# EAGLE schematic DCC-command-center-V2 (EAGLE 7.4.0)

## Sheet 1 of 3
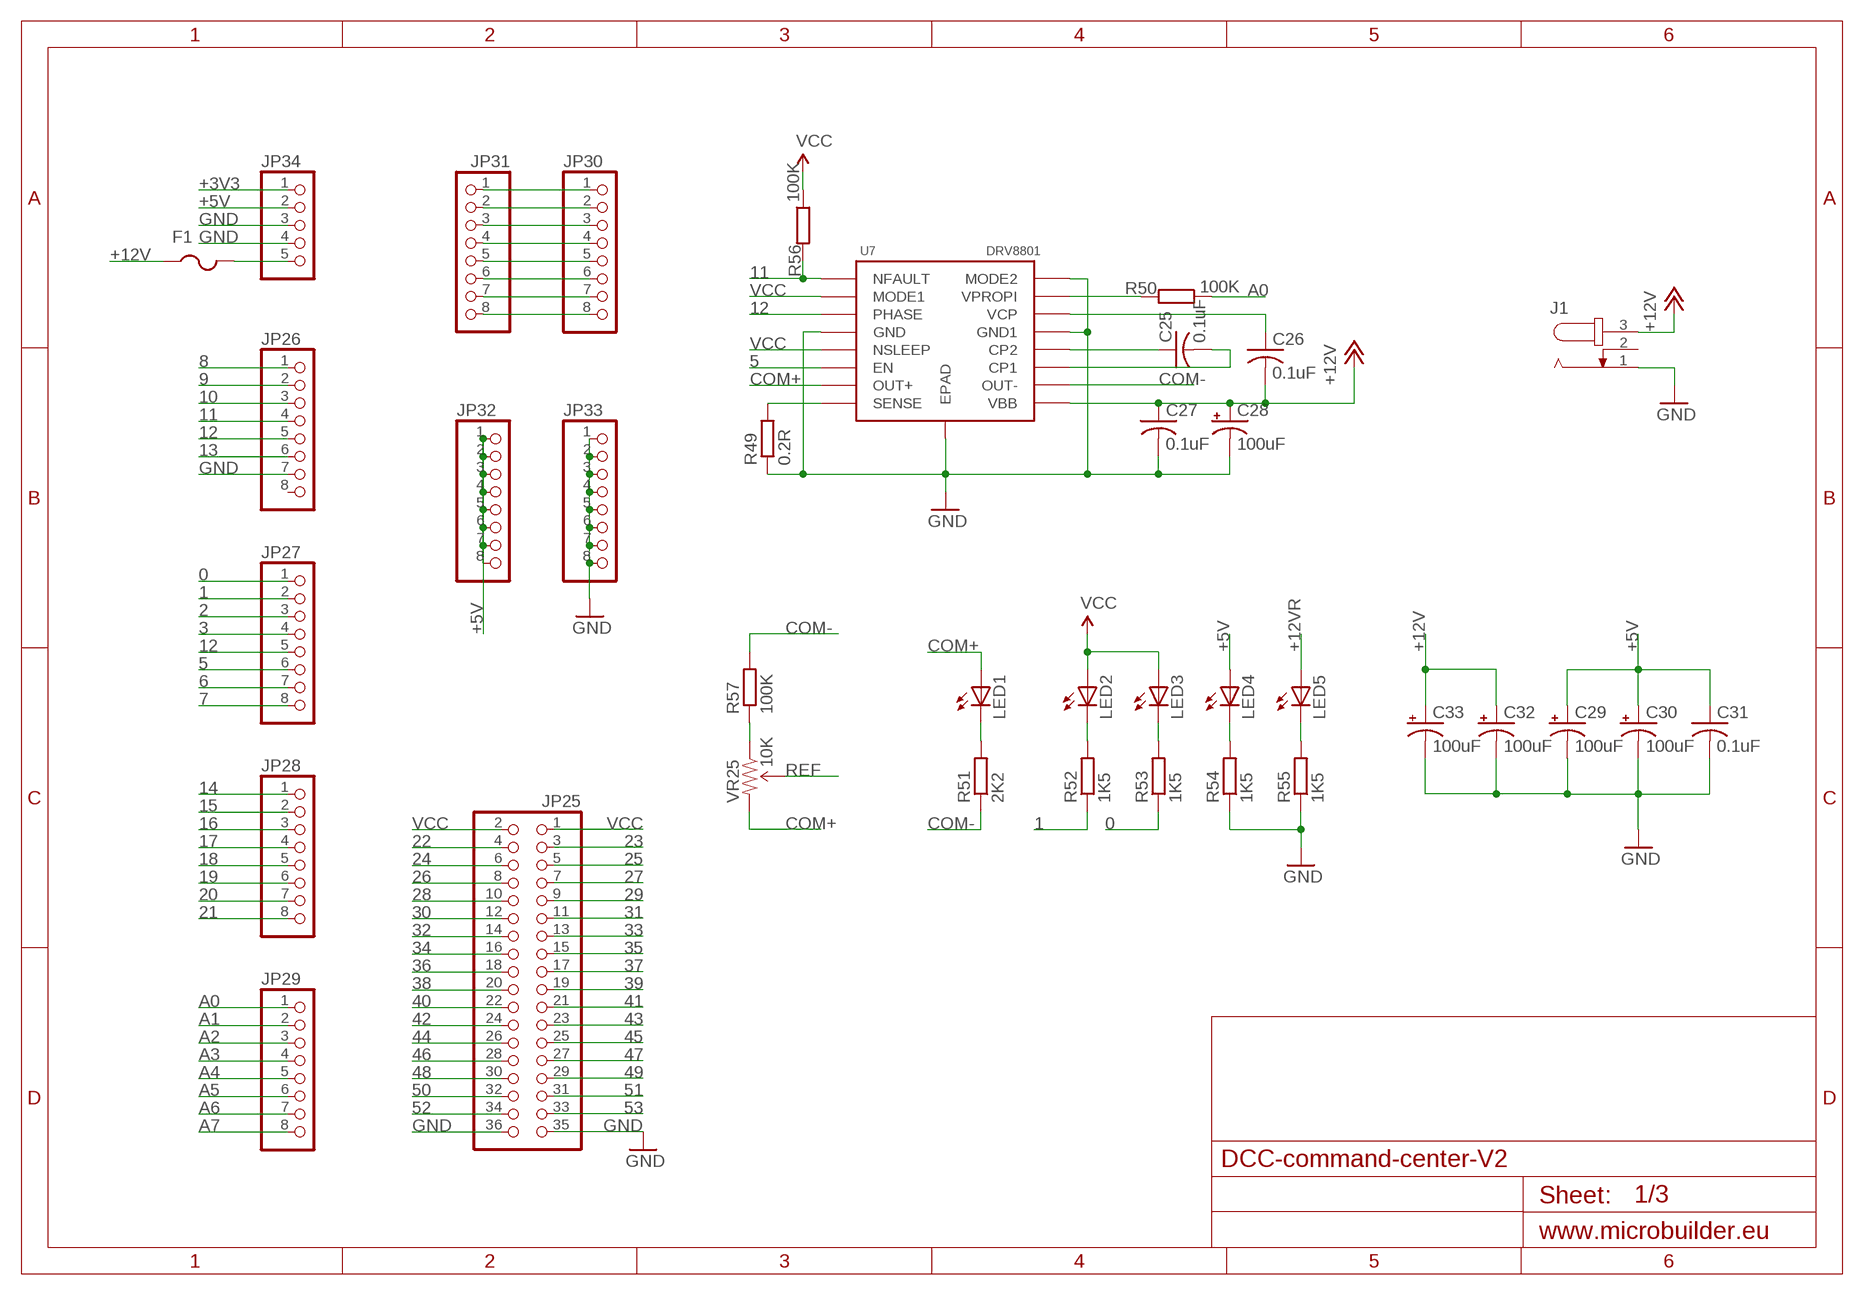
[diagram p0: schematic, sheet 1]

### Parts
C25  0.1uF  C-USC0603  [C0603]
C26  0.1uF  C-USC0603  [C0603]
C27  0.1uF  C-USC0603  [C0603]
C28  100uF  CPOL-US153CLV-0505  [153CLV-0505]
C29  100uF  CPOL-US153CLV-0505  [153CLV-0505]
C30  100uF  CPOL-US153CLV-0505  [153CLV-0505]
C31  0.1uF  C-USC0603  [C0603]
C32  100uF  CPOL-US153CLV-0505  [153CLV-0505]
C33  100uF  CPOL-US153CLV-0505  [153CLV-0505]
F1  PTCFUSE-1812  [1812]
J1  RAPC7120  [RAPC712]
JP25  PINHD-2X18_2.54  [2X18]
JP26  PINHD-1X08_2.54-S  [1X08-S]
JP27  PINHD-1X08_2.54-S  [1X08-S]
JP28  PINHD-1X08_2.54-S  [1X08-S]
JP29  PINHD-1X08_2.54-S  [1X08-S]
JP30  PINHD-1X08_2.54-S  [1X08-S]
JP31  PINHD-1X08_2.54-S  [1X08-S]
JP32  PINHD-1X08_2.54-S  [1X08-S]
JP33  PINHD-1X08_2.54-S  [1X08-S]
JP34  PINHD-1X05_2.54-S  [1X05-S]
LED1  LEDCHIP-LED0603  [CHIP-LED0603]
LED2  LEDCHIP-LED0603  [CHIP-LED0603]
LED3  LEDCHIP-LED0603  [CHIP-LED0603]
LED4  LEDCHIP-LED0603  [CHIP-LED0603]
LED5  LEDCHIP-LED0603  [CHIP-LED0603]
R49  0.2R  R-EU_R2512  [R2512]
R50  100K  R-EU_R0603  [R0603]
R51  2K2  R-EU_R0603  [R0603]
R52  1K5  R-EU_R0603  [R0603]
R53  1K5  R-EU_R0603  [R0603]
R54  1K5  R-EU_R0603  [R0603]
R55  1K5  R-EU_R0603  [R0603]
R56  100K  R-EU_R0603  [R0603]
R57  100K  R-EU_R0603  [R0603]
U7  DRV8801  [HTSSOP16]
VR25  10K  TRIMPOT3MM-2  [TRIMPOT-3MM-2]

### Nets
0: JP27.1 R53.1
1: JP27.2 R52.1
2: JP27.3
3: JP27.4
5: JP27.6 U7.P$6(EN)
6: JP27.7
7: JP27.8
8: JP26.1
9: JP26.2
10: JP26.3
11: JP26.4 R56.2 U7.P$1(NFAULT)
12: JP26.5 JP27.5 U7.P$3(PHASE)
13: JP26.6
14: JP28.1
15: JP28.2
16: JP28.3
17: JP28.4
18: JP28.5
19: JP28.6
20: JP28.7
21: JP28.8
22: JP25.4 ; also sheet 2
23: JP25.3 ; also sheet 2
24: JP25.6 ; also sheet 2
25: JP25.5 ; also sheet 2
26: JP25.8 ; also sheet 2
27: JP25.7 ; also sheet 2
28: JP25.10 ; also sheet 2
29: JP25.9 ; also sheet 2
30: JP25.12 ; also sheet 2
31: JP25.11 ; also sheet 2
32: JP25.14 ; also sheet 2
33: JP25.13 ; also sheet 2
34: JP25.16 ; also sheet 3
35: JP25.15 ; also sheet 3
36: JP25.18 ; also sheet 3
37: JP25.17 ; also sheet 3
38: JP25.20 ; also sheet 3
39: JP25.19 ; also sheet 3
40: JP25.22 ; also sheet 3
41: JP25.21 ; also sheet 3
42: JP25.24 ; also sheet 3
43: JP25.23 ; also sheet 3
44: JP25.26 ; also sheet 3
45: JP25.25 ; also sheet 3
46: JP25.28
47: JP25.27
48: JP25.30
49: JP25.29
50: JP25.32
51: JP25.31
52: JP25.34
53: JP25.33
+3V3: JP34.1
+5V: C29.+ C30.+ C31.1 JP32.1 JP32.2 JP32.3 JP32.4 JP32.5 JP32.6 JP32.7 JP32.8 JP34.2 LED4.A
+12V: C26.2 C27.1 C28.+ C32.+ C33.+ F1.1 J1.3 U7.P$9(VBB)
+12VR: F1.2 JP34.5 LED5.A
A0: JP29.1 R50.1
A1: JP29.2
A2: JP29.3
A3: JP29.4
A4: JP29.5
A5: JP29.6
A6: JP29.7
A7: JP29.8
COM+: LED1.A U7.P$7(OUT+) VR25.3(CW) ; also sheet 2,3
COM-: R51.1 R57.2 U7.P$10(OUT-) ; also sheet 2,3
GND: C27.2 C28.- C29.- C30.- C31.2 C32.- C33.- J1.1 JP25.35 JP25.36 JP26.7 JP33.1 JP33.2 JP33.3 JP33.4 JP33.5 JP33.6 JP33.7 JP33.8 JP34.3 JP34.4 R49.1 R54.1 R55.1 U7.P$4(GND) U7.P$13(GND1) U7.P$16(MODE2) U7.P$17(EPAD) ; also sheet 2,3
N$1: JP30.1 JP31.1
N$2: JP30.2 JP31.2
N$3: JP30.3 JP31.3
N$4: JP30.4 JP31.4
N$5: JP30.5 JP31.5
N$6: JP30.6 JP31.6
N$7: JP30.7 JP31.7
N$8: JP30.8 JP31.8
N$9: R49.2 U7.P$8(SENSE)
N$10: C25.1 U7.P$12(CP2)
N$11: C25.2 U7.P$11(CP1)
N$12: C26.1 U7.P$14(VCP)
N$13: R57.1 VR25.1(CCW)
N$14: R50.2 U7.P$15(VPROPI)
N$15: LED1.C R51.2
N$16: LED2.C R52.2
N$17: LED3.C R53.2
N$18: LED4.C R54.2
N$19: LED5.C R55.2
REF: VR25.2(WIPER) ; also sheet 2,3
VCC: JP25.1 JP25.2 LED2.A LED3.A R56.1 U7.P$2(MODE1) U7.P$5(NSLEEP) ; also sheet 2,3
Unconnected: J1.2 JP26.8

## Sheet 2 of 3
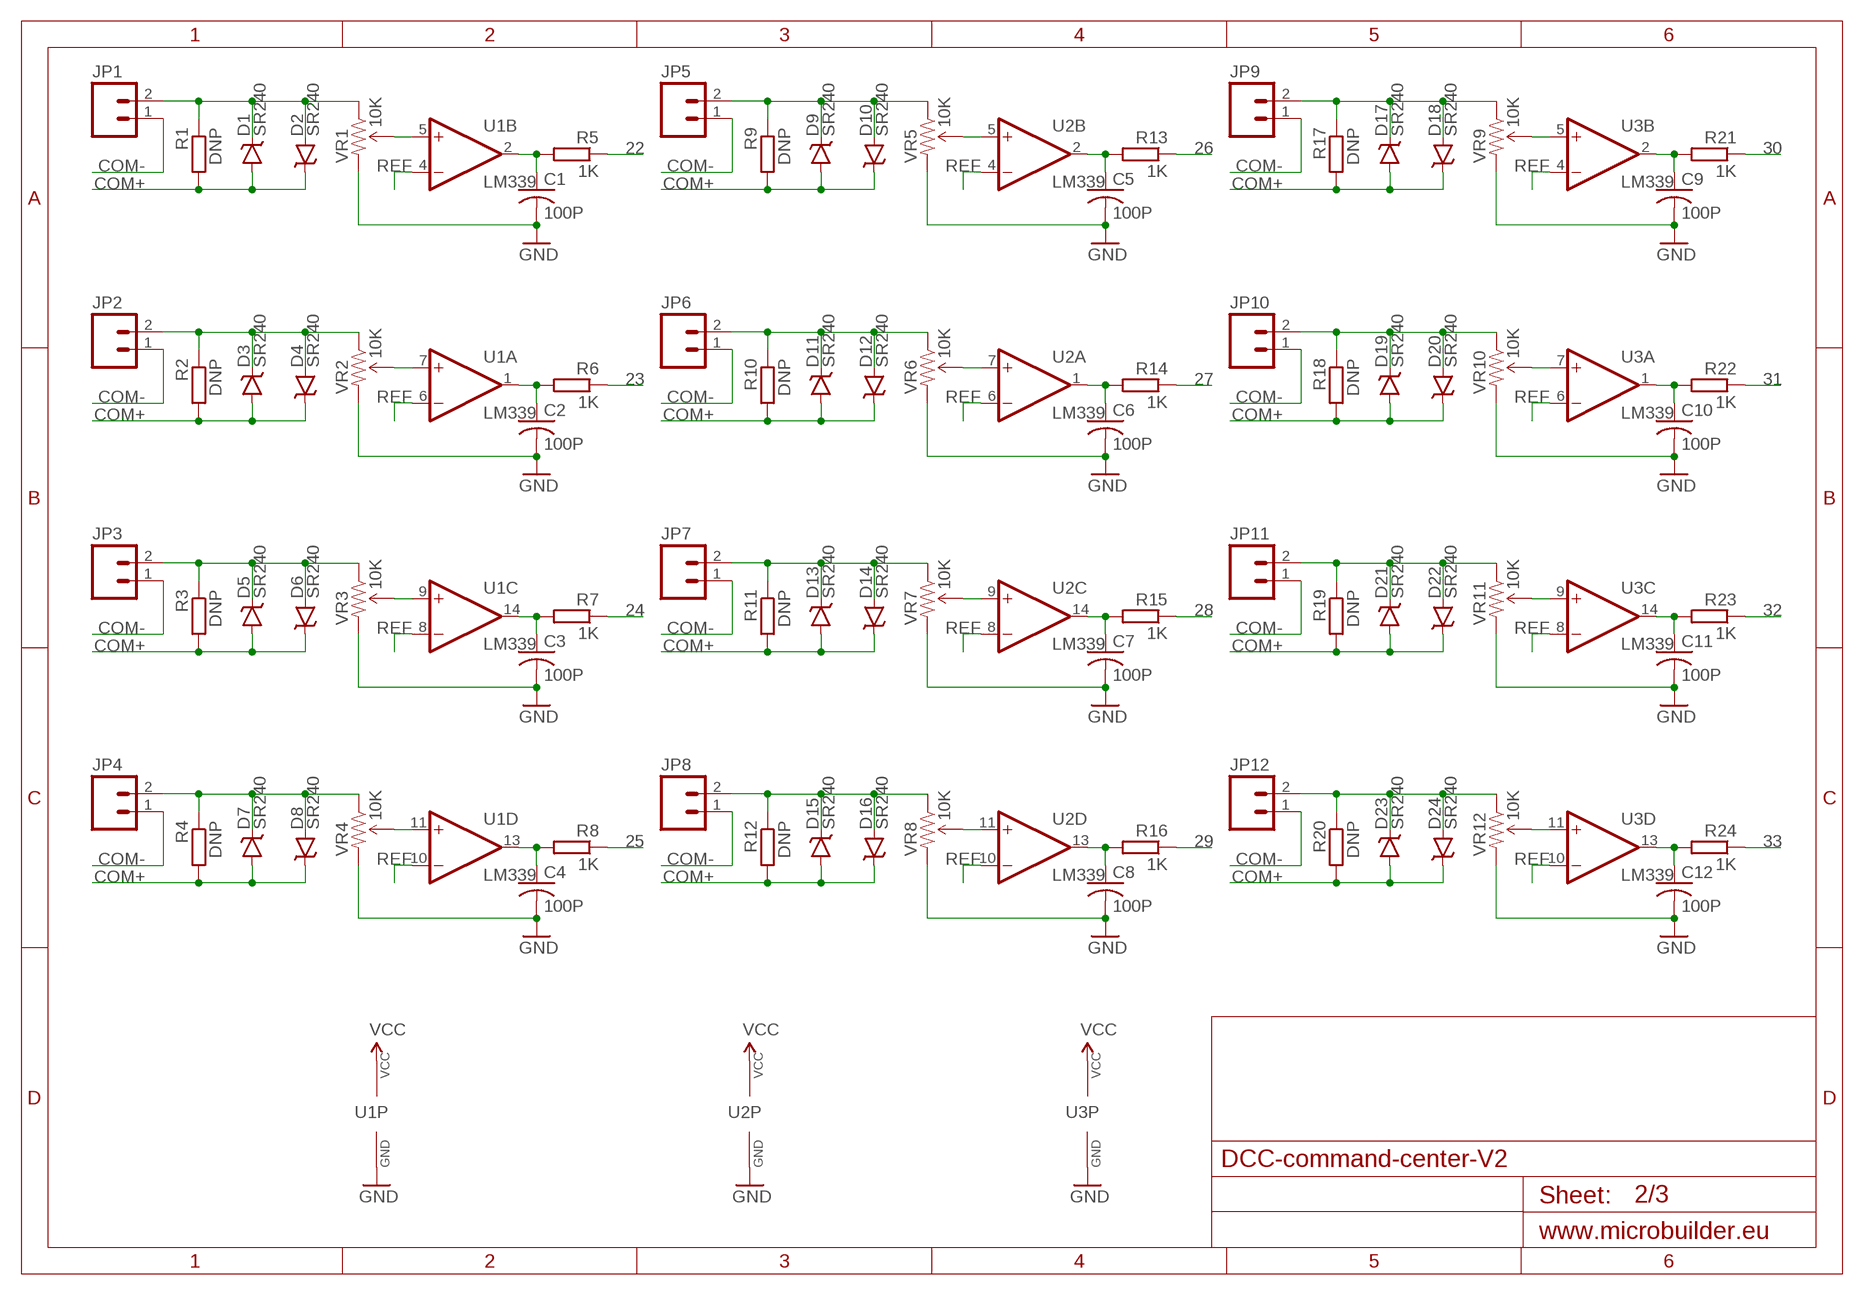
[diagram p1: schematic, sheet 2]

### Parts
C1  100P  C-USC0603  [C0603]
C2  100P  C-USC0603  [C0603]
C3  100P  C-USC0603  [C0603]
C4  100P  C-USC0603  [C0603]
C5  100P  C-USC0603  [C0603]
C6  100P  C-USC0603  [C0603]
C7  100P  C-USC0603  [C0603]
C8  100P  C-USC0603  [C0603]
C9  100P  C-USC0603  [C0603]
C10  100P  C-USC0603  [C0603]
C11  100P  C-USC0603  [C0603]
C12  100P  C-USC0603  [C0603]
D1  SR240  B340A  [SMA-DIODE]
D2  SR240  B340A  [SMA-DIODE]
D3  SR240  B340A  [SMA-DIODE]
D4  SR240  B340A  [SMA-DIODE]
D5  SR240  B340A  [SMA-DIODE]
D6  SR240  B340A  [SMA-DIODE]
D7  SR240  B340A  [SMA-DIODE]
D8  SR240  B340A  [SMA-DIODE]
D9  SR240  B340A  [SMA-DIODE]
D10  SR240  B340A  [SMA-DIODE]
D11  SR240  B340A  [SMA-DIODE]
D12  SR240  B340A  [SMA-DIODE]
D13  SR240  B340A  [SMA-DIODE]
D14  SR240  B340A  [SMA-DIODE]
D15  SR240  B340A  [SMA-DIODE]
D16  SR240  B340A  [SMA-DIODE]
D17  SR240  B340A  [SMA-DIODE]
D18  SR240  B340A  [SMA-DIODE]
D19  SR240  B340A  [SMA-DIODE]
D20  SR240  B340A  [SMA-DIODE]
D21  SR240  B340A  [SMA-DIODE]
D22  SR240  B340A  [SMA-DIODE]
D23  SR240  B340A  [SMA-DIODE]
D24  SR240  B340A  [SMA-DIODE]
JP1  M02POGO_PIN_HOLES_ONLY  [1X02_PP_HOLES_ONLY]
JP2  M02POGO_PIN_HOLES_ONLY  [1X02_PP_HOLES_ONLY]
JP3  M02POGO_PIN_HOLES_ONLY  [1X02_PP_HOLES_ONLY]
JP4  M02POGO_PIN_HOLES_ONLY  [1X02_PP_HOLES_ONLY]
JP5  M02POGO_PIN_HOLES_ONLY  [1X02_PP_HOLES_ONLY]
JP6  M02POGO_PIN_HOLES_ONLY  [1X02_PP_HOLES_ONLY]
JP7  M02POGO_PIN_HOLES_ONLY  [1X02_PP_HOLES_ONLY]
JP8  M02POGO_PIN_HOLES_ONLY  [1X02_PP_HOLES_ONLY]
JP9  M02POGO_PIN_HOLES_ONLY  [1X02_PP_HOLES_ONLY]
JP10  M02POGO_PIN_HOLES_ONLY  [1X02_PP_HOLES_ONLY]
JP11  M02POGO_PIN_HOLES_ONLY  [1X02_PP_HOLES_ONLY]
JP12  M02POGO_PIN_HOLES_ONLY  [1X02_PP_HOLES_ONLY]
R1  DNP  R-EU_R0603  [R0603]
R2  DNP  R-EU_R0603  [R0603]
R3  DNP  R-EU_R0603  [R0603]
R4  DNP  R-EU_R0603  [R0603]
R5  1K  R-EU_R0603  [R0603]
R6  1K  R-EU_R0603  [R0603]
R7  1K  R-EU_R0603  [R0603]
R8  1K  R-EU_R0603  [R0603]
R9  DNP  R-EU_R0603  [R0603]
R10  DNP  R-EU_R0603  [R0603]
R11  DNP  R-EU_R0603  [R0603]
R12  DNP  R-EU_R0603  [R0603]
R13  1K  R-EU_R0603  [R0603]
R14  1K  R-EU_R0603  [R0603]
R15  1K  R-EU_R0603  [R0603]
R16  1K  R-EU_R0603  [R0603]
R17  DNP  R-EU_R0603  [R0603]
R18  DNP  R-EU_R0603  [R0603]
R19  DNP  R-EU_R0603  [R0603]
R20  DNP  R-EU_R0603  [R0603]
R21  1K  R-EU_R0603  [R0603]
R22  1K  R-EU_R0603  [R0603]
R23  1K  R-EU_R0603  [R0603]
R24  1K  R-EU_R0603  [R0603]
U1  LM339  [TSSOP-14]
U2  LM339  [TSSOP-14]
U3  LM339  [TSSOP-14]
VR1  10K  TRIMPOT3MM-2  [TRIMPOT-3MM-2]
VR2  10K  TRIMPOT3MM-2  [TRIMPOT-3MM-2]
VR3  10K  TRIMPOT3MM-2  [TRIMPOT-3MM-2]
VR4  10K  TRIMPOT3MM-2  [TRIMPOT-3MM-2]
VR5  10K  TRIMPOT3MM-2  [TRIMPOT-3MM-2]
VR6  10K  TRIMPOT3MM-2  [TRIMPOT-3MM-2]
VR7  10K  TRIMPOT3MM-2  [TRIMPOT-3MM-2]
VR8  10K  TRIMPOT3MM-2  [TRIMPOT-3MM-2]
VR9  10K  TRIMPOT3MM-2  [TRIMPOT-3MM-2]
VR10  10K  TRIMPOT3MM-2  [TRIMPOT-3MM-2]
VR11  10K  TRIMPOT3MM-2  [TRIMPOT-3MM-2]
VR12  10K  TRIMPOT3MM-2  [TRIMPOT-3MM-2]

### Nets
22: R5.1 ; also sheet 1
23: R6.1 ; also sheet 1
24: R7.1 ; also sheet 1
25: R8.1 ; also sheet 1
26: R13.1 ; also sheet 1
27: R14.1 ; also sheet 1
28: R15.1 ; also sheet 1
29: R16.1 ; also sheet 1
30: R21.1 ; also sheet 1
31: R22.1 ; also sheet 1
32: R23.1 ; also sheet 1
33: R24.1 ; also sheet 1
COM+: D1.A D2.C D3.A D4.C D5.A D6.C D7.A D8.C D9.A D10.C D11.A D12.C D13.A D14.C D15.A D16.C D17.A D18.C D19.A D20.C D21.A D22.C D23.A D24.C R1.2 R2.2 R3.2 R4.2 R9.2 R10.2 R11.2 R12.2 R17.2 R18.2 R19.2 R20.2 ; also sheet 1,3
COM-: JP1.1 JP2.1 JP3.1 JP4.1 JP5.1 JP6.1 JP7.1 JP8.1 JP9.1 JP10.1 JP11.1 JP12.1 ; also sheet 1,3
GND: C1.2 C2.2 C3.2 C4.2 C5.2 C6.2 C7.2 C8.2 C9.2 C10.2 C11.2 C12.2 U1.12(P:GND) U2.12(P:GND) U3.12(P:GND) VR1.3(CW) VR2.3(CW) VR3.3(CW) VR4.3(CW) VR5.3(CW) VR6.3(CW) VR7.3(CW) VR8.3(CW) VR9.3(CW) VR10.3(CW) VR11.3(CW) VR12.3(CW) ; also sheet 1,3
JP1: D1.C D2.A JP1.2 R1.1 VR1.1(CCW)
JP2: D3.C D4.A JP2.2 R2.1 VR2.1(CCW)
JP3: D5.C D6.A JP3.2 R3.1 VR3.1(CCW)
JP4: D7.C D8.A JP4.2 R4.1 VR4.1(CCW)
JP5: D9.C D10.A JP5.2 R9.1 VR5.1(CCW)
JP6: D11.C D12.A JP6.2 R10.1 VR6.1(CCW)
JP7: D13.C D14.A JP7.2 R11.1 VR7.1(CCW)
JP8: D15.C D16.A JP8.2 R12.1 VR8.1(CCW)
JP9: D17.C D18.A JP9.2 R17.1 VR9.1(CCW)
JP10: D19.C D20.A JP10.2 R18.1 VR10.1(CCW)
JP11: D21.C D22.A JP11.2 R19.1 VR11.1(CCW)
JP12: D23.C D24.A JP12.2 R20.1 VR12.1(CCW)
OP1: C1.1 R5.2 U1.2(B:OUT)
OP2: C2.1 R6.2 U1.1(A:OUT)
OP3: C3.1 R7.2 U1.14(C:OUT)
OP4: C4.1 R8.2 U1.13(D:OUT)
OP5: C5.1 R13.2 U2.2(B:OUT)
OP6: C6.1 R14.2 U2.1(A:OUT)
OP7: C7.1 R15.2 U2.14(C:OUT)
OP8: C8.1 R16.2 U2.13(D:OUT)
OP9: C9.1 R21.2 U3.2(B:OUT)
OP10: C10.1 R22.2 U3.1(A:OUT)
OP11: C11.1 R23.2 U3.14(C:OUT)
OP12: C12.1 R24.2 U3.13(D:OUT)
REF: U1.4(B:-IN) U1.6(A:-IN) U1.8(C:-IN) U1.10(D:-IN) U2.4(B:-IN) U2.6(A:-IN) U2.8(C:-IN) U2.10(D:-IN) U3.4(B:-IN) U3.6(A:-IN) U3.8(C:-IN) U3.10(D:-IN) ; also sheet 1,3
VCC: U1.3(P:VCC) U2.3(P:VCC) U3.3(P:VCC) ; also sheet 1,3
VR1: U1.5(B:+IN) VR1.2(WIPER)
VR2: U1.7(A:+IN) VR2.2(WIPER)
VR3: U1.9(C:+IN) VR3.2(WIPER)
VR4: U1.11(D:+IN) VR4.2(WIPER)
VR5: U2.5(B:+IN) VR5.2(WIPER)
VR6: U2.7(A:+IN) VR6.2(WIPER)
VR7: U2.9(C:+IN) VR7.2(WIPER)
VR8: U2.11(D:+IN) VR8.2(WIPER)
VR9: U3.5(B:+IN) VR9.2(WIPER)
VR10: U3.7(A:+IN) VR10.2(WIPER)
VR11: U3.9(C:+IN) VR11.2(WIPER)
VR12: U3.11(D:+IN) VR12.2(WIPER)

## Sheet 3 of 3
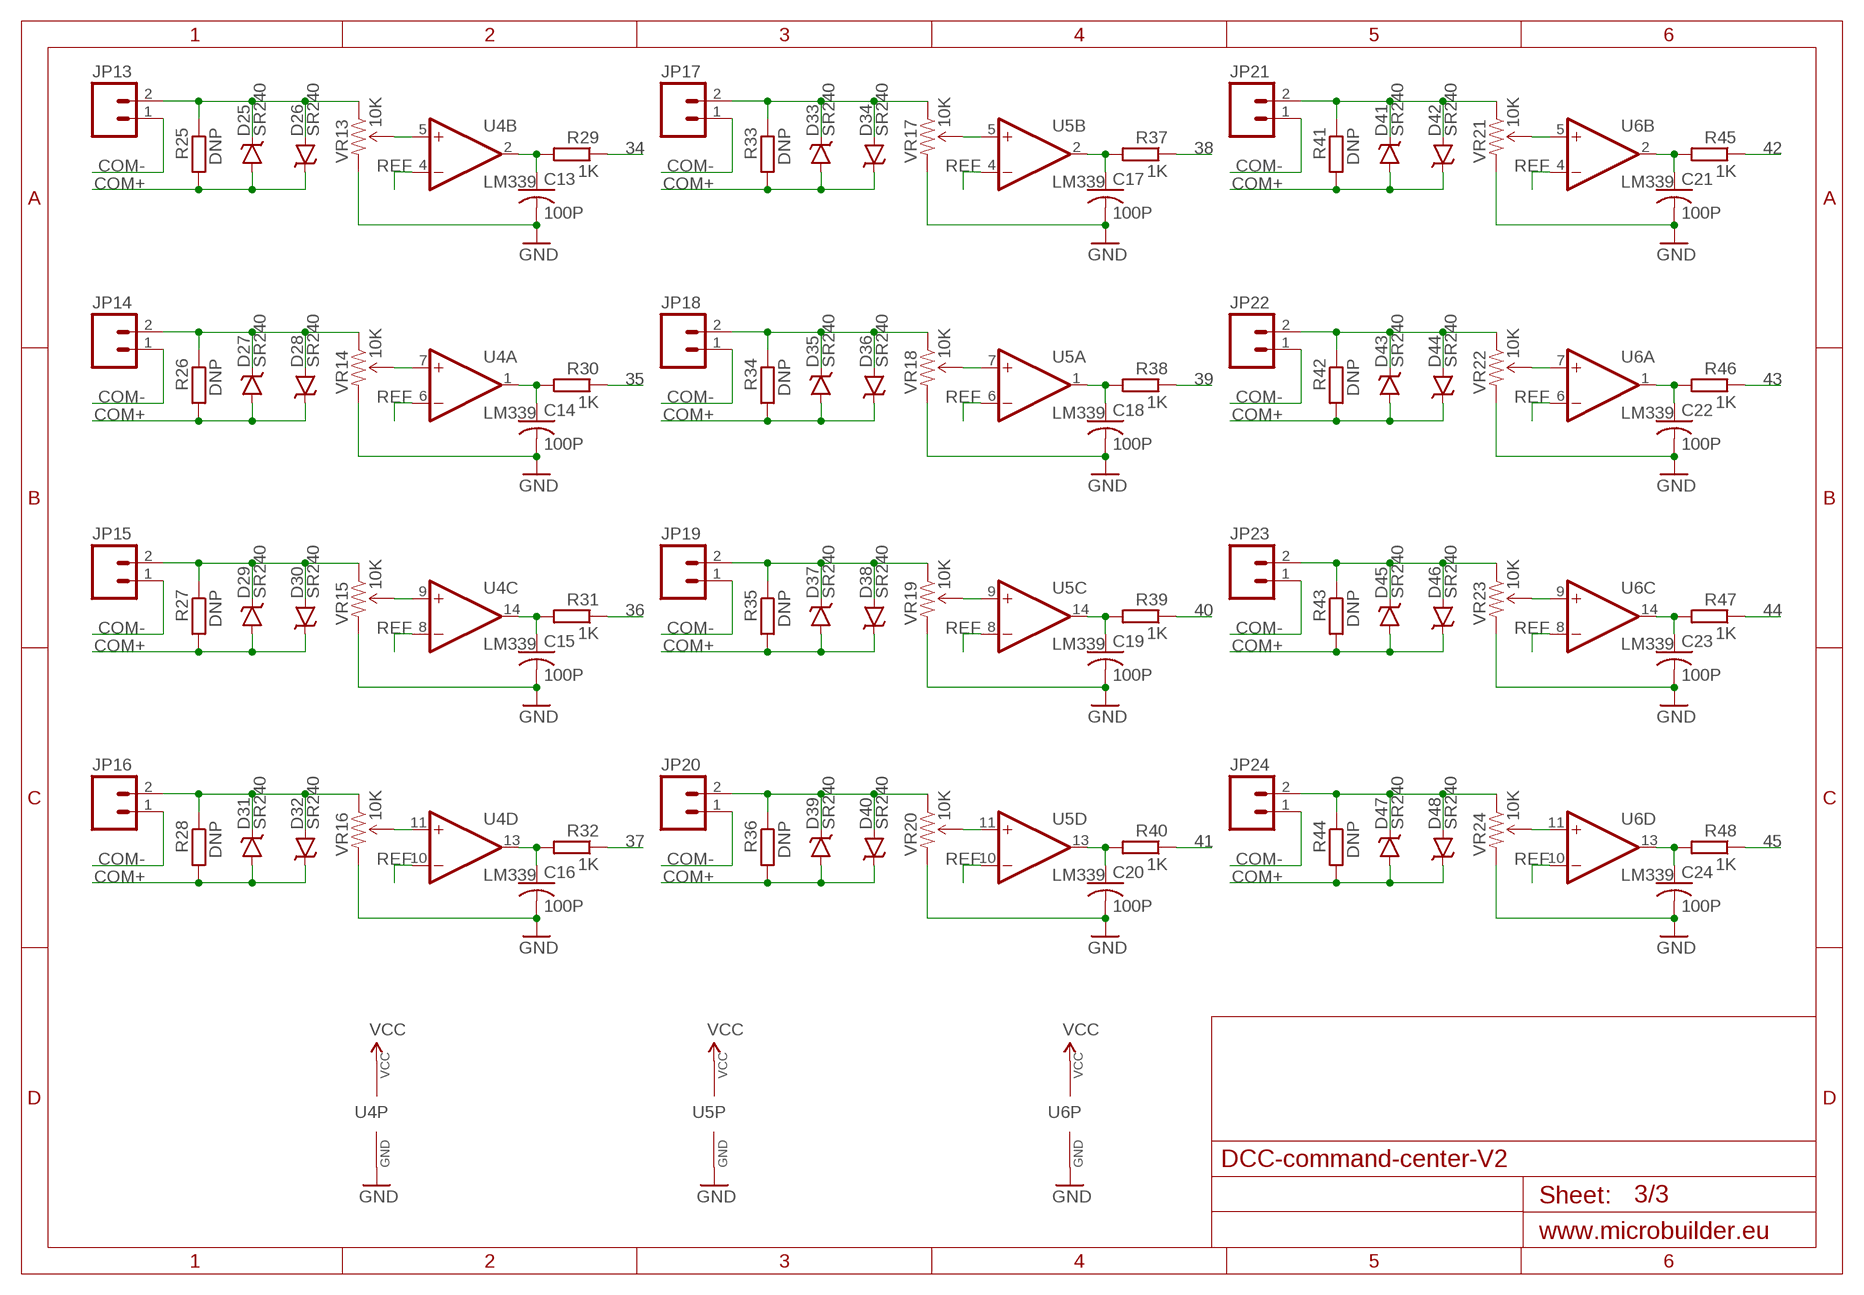
[diagram p2: schematic, sheet 3]

### Parts
C13  100P  C-USC0603  [C0603]
C14  100P  C-USC0603  [C0603]
C15  100P  C-USC0603  [C0603]
C16  100P  C-USC0603  [C0603]
C17  100P  C-USC0603  [C0603]
C18  100P  C-USC0603  [C0603]
C19  100P  C-USC0603  [C0603]
C20  100P  C-USC0603  [C0603]
C21  100P  C-USC0603  [C0603]
C22  100P  C-USC0603  [C0603]
C23  100P  C-USC0603  [C0603]
C24  100P  C-USC0603  [C0603]
D25  SR240  B340A  [SMA-DIODE]
D26  SR240  B340A  [SMA-DIODE]
D27  SR240  B340A  [SMA-DIODE]
D28  SR240  B340A  [SMA-DIODE]
D29  SR240  B340A  [SMA-DIODE]
D30  SR240  B340A  [SMA-DIODE]
D31  SR240  B340A  [SMA-DIODE]
D32  SR240  B340A  [SMA-DIODE]
D33  SR240  B340A  [SMA-DIODE]
D34  SR240  B340A  [SMA-DIODE]
D35  SR240  B340A  [SMA-DIODE]
D36  SR240  B340A  [SMA-DIODE]
D37  SR240  B340A  [SMA-DIODE]
D38  SR240  B340A  [SMA-DIODE]
D39  SR240  B340A  [SMA-DIODE]
D40  SR240  B340A  [SMA-DIODE]
D41  SR240  B340A  [SMA-DIODE]
D42  SR240  B340A  [SMA-DIODE]
D43  SR240  B340A  [SMA-DIODE]
D44  SR240  B340A  [SMA-DIODE]
D45  SR240  B340A  [SMA-DIODE]
D46  SR240  B340A  [SMA-DIODE]
D47  SR240  B340A  [SMA-DIODE]
D48  SR240  B340A  [SMA-DIODE]
JP13  M02POGO_PIN_HOLES_ONLY  [1X02_PP_HOLES_ONLY]
JP14  M02POGO_PIN_HOLES_ONLY  [1X02_PP_HOLES_ONLY]
JP15  M02POGO_PIN_HOLES_ONLY  [1X02_PP_HOLES_ONLY]
JP16  M02POGO_PIN_HOLES_ONLY  [1X02_PP_HOLES_ONLY]
JP17  M02POGO_PIN_HOLES_ONLY  [1X02_PP_HOLES_ONLY]
JP18  M02POGO_PIN_HOLES_ONLY  [1X02_PP_HOLES_ONLY]
JP19  M02POGO_PIN_HOLES_ONLY  [1X02_PP_HOLES_ONLY]
JP20  M02POGO_PIN_HOLES_ONLY  [1X02_PP_HOLES_ONLY]
JP21  M02POGO_PIN_HOLES_ONLY  [1X02_PP_HOLES_ONLY]
JP22  M02POGO_PIN_HOLES_ONLY  [1X02_PP_HOLES_ONLY]
JP23  M02POGO_PIN_HOLES_ONLY  [1X02_PP_HOLES_ONLY]
JP24  M02POGO_PIN_HOLES_ONLY  [1X02_PP_HOLES_ONLY]
R25  DNP  R-EU_R0603  [R0603]
R26  DNP  R-EU_R0603  [R0603]
R27  DNP  R-EU_R0603  [R0603]
R28  DNP  R-EU_R0603  [R0603]
R29  1K  R-EU_R0603  [R0603]
R30  1K  R-EU_R0603  [R0603]
R31  1K  R-EU_R0603  [R0603]
R32  1K  R-EU_R0603  [R0603]
R33  DNP  R-EU_R0603  [R0603]
R34  DNP  R-EU_R0603  [R0603]
R35  DNP  R-EU_R0603  [R0603]
R36  DNP  R-EU_R0603  [R0603]
R37  1K  R-EU_R0603  [R0603]
R38  1K  R-EU_R0603  [R0603]
R39  1K  R-EU_R0603  [R0603]
R40  1K  R-EU_R0603  [R0603]
R41  DNP  R-EU_R0603  [R0603]
R42  DNP  R-EU_R0603  [R0603]
R43  DNP  R-EU_R0603  [R0603]
R44  DNP  R-EU_R0603  [R0603]
R45  1K  R-EU_R0603  [R0603]
R46  1K  R-EU_R0603  [R0603]
R47  1K  R-EU_R0603  [R0603]
R48  1K  R-EU_R0603  [R0603]
U4  LM339  [TSSOP-14]
U5  LM339  [TSSOP-14]
U6  LM339  [TSSOP-14]
VR13  10K  TRIMPOT3MM-2  [TRIMPOT-3MM-2]
VR14  10K  TRIMPOT3MM-2  [TRIMPOT-3MM-2]
VR15  10K  TRIMPOT3MM-2  [TRIMPOT-3MM-2]
VR16  10K  TRIMPOT3MM-2  [TRIMPOT-3MM-2]
VR17  10K  TRIMPOT3MM-2  [TRIMPOT-3MM-2]
VR18  10K  TRIMPOT3MM-2  [TRIMPOT-3MM-2]
VR19  10K  TRIMPOT3MM-2  [TRIMPOT-3MM-2]
VR20  10K  TRIMPOT3MM-2  [TRIMPOT-3MM-2]
VR21  10K  TRIMPOT3MM-2  [TRIMPOT-3MM-2]
VR22  10K  TRIMPOT3MM-2  [TRIMPOT-3MM-2]
VR23  10K  TRIMPOT3MM-2  [TRIMPOT-3MM-2]
VR24  10K  TRIMPOT3MM-2  [TRIMPOT-3MM-2]

### Nets
34: R29.1 ; also sheet 1
35: R30.1 ; also sheet 1
36: R31.1 ; also sheet 1
37: R32.1 ; also sheet 1
38: R37.1 ; also sheet 1
39: R38.1 ; also sheet 1
40: R39.1 ; also sheet 1
41: R40.1 ; also sheet 1
42: R45.1 ; also sheet 1
43: R46.1 ; also sheet 1
44: R47.1 ; also sheet 1
45: R48.1 ; also sheet 1
COM+: D25.A D26.C D27.A D28.C D29.A D30.C D31.A D32.C D33.A D34.C D35.A D36.C D37.A D38.C D39.A D40.C D41.A D42.C D43.A D44.C D45.A D46.C D47.A D48.C R25.2 R26.2 R27.2 R28.2 R33.2 R34.2 R35.2 R36.2 R41.2 R42.2 R43.2 R44.2 ; also sheet 1,2
COM-: JP13.1 JP14.1 JP15.1 JP16.1 JP17.1 JP18.1 JP19.1 JP20.1 JP21.1 JP22.1 JP23.1 JP24.1 ; also sheet 1,2
GND: C13.2 C14.2 C15.2 C16.2 C17.2 C18.2 C19.2 C20.2 C21.2 C22.2 C23.2 C24.2 U4.12(P:GND) U5.12(P:GND) U6.12(P:GND) VR13.3(CW) VR14.3(CW) VR15.3(CW) VR16.3(CW) VR17.3(CW) VR18.3(CW) VR19.3(CW) VR20.3(CW) VR21.3(CW) VR22.3(CW) VR23.3(CW) VR24.3(CW) ; also sheet 1,2
JP13: D25.C D26.A JP13.2 R25.1 VR13.1(CCW)
JP14: D27.C D28.A JP14.2 R26.1 VR14.1(CCW)
JP15: D29.C D30.A JP15.2 R27.1 VR15.1(CCW)
JP16: D31.C D32.A JP16.2 R28.1 VR16.1(CCW)
JP17: D33.C D34.A JP17.2 R33.1 VR17.1(CCW)
JP18: D35.C D36.A JP18.2 R34.1 VR18.1(CCW)
JP19: D37.C D38.A JP19.2 R35.1 VR19.1(CCW)
JP20: D39.C D40.A JP20.2 R36.1 VR20.1(CCW)
JP21: D41.C D42.A JP21.2 R41.1 VR21.1(CCW)
JP22: D43.C D44.A JP22.2 R42.1 VR22.1(CCW)
JP23: D45.C D46.A JP23.2 R43.1 VR23.1(CCW)
JP24: D47.C D48.A JP24.2 R44.1 VR24.1(CCW)
OP13: C13.1 R29.2 U4.2(B:OUT)
OP14: C14.1 R30.2 U4.1(A:OUT)
OP15: C15.1 R31.2 U4.14(C:OUT)
OP16: C16.1 R32.2 U4.13(D:OUT)
OP17: C17.1 R37.2 U5.2(B:OUT)
OP18: C18.1 R38.2 U5.1(A:OUT)
OP19: C19.1 R39.2 U5.14(C:OUT)
OP20: C20.1 R40.2 U5.13(D:OUT)
OP21: C21.1 R45.2 U6.2(B:OUT)
OP22: C22.1 R46.2 U6.1(A:OUT)
OP23: C23.1 R47.2 U6.14(C:OUT)
OP24: C24.1 R48.2 U6.13(D:OUT)
REF: U4.4(B:-IN) U4.6(A:-IN) U4.8(C:-IN) U4.10(D:-IN) U5.4(B:-IN) U5.6(A:-IN) U5.8(C:-IN) U5.10(D:-IN) U6.4(B:-IN) U6.6(A:-IN) U6.8(C:-IN) U6.10(D:-IN) ; also sheet 1,2
VCC: U4.3(P:VCC) U5.3(P:VCC) U6.3(P:VCC) ; also sheet 1,2
VR13: U4.5(B:+IN) VR13.2(WIPER)
VR14: U4.7(A:+IN) VR14.2(WIPER)
VR15: U4.9(C:+IN) VR15.2(WIPER)
VR16: U4.11(D:+IN) VR16.2(WIPER)
VR17: U5.5(B:+IN) VR17.2(WIPER)
VR18: U5.7(A:+IN) VR18.2(WIPER)
VR19: U5.9(C:+IN) VR19.2(WIPER)
VR20: U5.11(D:+IN) VR20.2(WIPER)
VR21: U6.5(B:+IN) VR21.2(WIPER)
VR22: U6.7(A:+IN) VR22.2(WIPER)
VR23: U6.9(C:+IN) VR23.2(WIPER)
VR24: U6.11(D:+IN) VR24.2(WIPER)

## Library data of the parts
C1-C27 C31 = adafruit:C-US: CAPACITOR, American symbol
C28-C30 C32 C33 = adafruit:CPOL-US: POLARIZED CAPACITOR, American symbol
D1-D48 = SparkFun-DiscreteSemi:B340A: Schottky Diode 3A-40V; PROD_ID: DIO-09886; VALUE: BA340A
F1 = adafruit:PTCFUSE: PTC fuses, resettable thermistors
J1 = RepRapjr:RAPC712: DC POWER JACK Power Jack, DC, Right Angle, Through Hole, Rated 5A at 16VDC, PC Terminals Distributor: Farnell (www.Farnell.de) Drawing: 84N1161.pdf / 84N1162.pdf Manufacturer: SPC Technology (www.spctechnology.com) Type: SPC4077 / SPC 4078
JP1-JP24 = SparkFun-Connectors:M02: Standard 2-pin 0.1" header. Use with - straight break away headers ( PRT-00116) - right angle break away headers (PRT-00553) - swiss pins (PRT-00743) - machine pins (PRT-00117) - female headers (PRT-00115) Molex polarized connector foot print use with: PRT-08233 with associated crimp pins and housings. 2.54_SCREWTERM for use with PRT-10571. 3.5mm Screw Terminal footprints for PRT-08084 5mm Screw Terminal footprints for use with PRT-08432
JP25 = pinhead-2:PINHD-2X18: PIN HEADER
JP26-JP33 = pinhead-2:PINHD-1X08: PIN HEADER
JP34 = pinhead-2:PINHD-1X05: PIN HEADER
LED1-LED5 = adafruit:LED: LED OSRAM: - CHIPLED LG R971, LG N971, LY N971, LG Q971, LY Q971, LO R971, LY R971 LH N974, LH R974 LS Q976, LO Q976, LY Q976 LO Q996 - Hyper CHIPLED LW Q18S LB Q993, LB Q99A, LB R99A - SideLED LS A670, LO A670, LY A670, LG A670, LP A670 LB A673, LV A673, LT A673, LW A673 LH A674 LY A675 LS A676, LA A676, LO A676, LY A676, LW A676 LS A679, LY A679, LG A679 - Hyper Micro SIDELED® LS Y876, LA Y876, LO Y876, LY Y876 LT Y87S - SmartLED LW L88C, LW L88S LB L89C, LB L89S, LG L890 LS L89K, LO L89K, LY L89K LS L896, LA L896, LO L896, LY L896 - TOPLED LS T670, LO T670, LY T670, LG T670, LP T670 LSG T670, LSP T670, LSY T670, LOP T670, LYG T670 LG T671, LOG T671, LSG T671 LB T673, LV T673, LT T673, LW T673 LH T674 LS T676, LA T676, LO T676, LY T676, LB T676, LH T676, LSB T676, LW T676 LB T67C, LV T67C, LT T67C, LS T67K, LO T67K, LY T67K, LW E67C LS E67B, LA E67B, LO E67B, LY E67B, LB E67C, LV E67C, LT E67C LW T67C LS T679, LY T679, LG T679 LS T770, LO T770, LY T770, LG T770, LP T770 LB T773, LV T773, LT T773, LW T773 LH T774 LS E675, LA E675, LY E675, LS T675 LS T776, LA T776, LO T776, LY T776, LB T776 LHGB T686 LT T68C, LB T68C - Hyper Mini TOPLED® LB M676 - Mini TOPLED Santana® LG M470 LS M47K, LO M47K, LY M47K Source: http://www.osram.convergy.de/
R1-R57 = rcl:R-EU_: RESISTOR, European symbol
U1-U6 = SparkFun-AnalogIC:LM339: Based on information from the SLCS006N datasheet from TI (www.ti.com). Change Log Date Author Change July 16, 2008 nick@scantool.net Device created.; DESC: IC, Quad Comparator; MANUF: Texas Instruments; PARTNUM: LM339PWR; SUPPLIER: Digikey:296-6607-1-ND; VALSTAT: PARTNUM
U7 = microbuilder:DRV8801
VR1-VR25 = SparkFun-Electromechanical:TRIMPOT: Various small potentiometers for "set-and-forget" applications